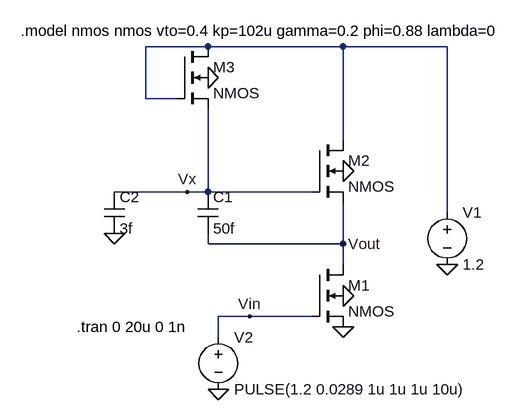
[diagram p0: schematic HW12.asc]
HW12.asc, the LTspice schematic file:
Version 4
SHEET 1 888 680
WIRE -64 -240 -160 -240
WIRE 144 -240 -64 -240
WIRE 304 -240 144 -240
WIRE -160 -160 -160 -240
WIRE -112 -160 -160 -160
WIRE 144 -96 144 -240
WIRE -96 -16 -208 -16
WIRE -64 -16 -64 -144
WIRE -64 -16 -96 -16
WIRE 96 -16 -64 -16
WIRE 304 16 304 -240
WIRE -64 64 -64 48
WIRE 144 64 144 0
WIRE 144 64 -64 64
WIRE 144 96 144 64
WIRE 0 176 -48 176
WIRE 96 176 0 176
WIRE -48 208 -48 176
FLAG 144 -48 0
FLAG 144 144 0
FLAG -64 -192 0
FLAG -208 48 0
FLAG 304 96 0
FLAG 144 192 0
FLAG -48 288 0
FLAG 0 176 Vin
FLAG 144 64 Vout
FLAG -96 -16 Vx
SYMBOL nmos4 96 96 R0
SYMATTR InstName M1
SYMATTR Value2 l=0.1u w=1u
SYMBOL nmos4 96 -96 R0
SYMATTR InstName M2
SYMATTR Value2 l=0.1u w=0.5u
SYMBOL nmos4 -112 -240 R0
SYMATTR InstName M3
SYMATTR Value2 l=0.1u w=0.5u
SYMBOL voltage 304 0 R0
SYMATTR InstName V1
SYMATTR Value 1.2
SYMBOL cap -80 -16 R0
SYMATTR InstName C1
SYMATTR Value 50f
SYMBOL cap -224 -16 R0
SYMATTR InstName C2
SYMATTR Value 3f
SYMBOL voltage -48 192 R0
WINDOW 123 0 0 Left 2
WINDOW 39 0 0 Left 2
SYMATTR InstName V2
SYMATTR Value PULSE(1.2 0.0289 1u 1u 1u 10u)
TEXT -352 -264 Left 2 !.model nmos nmos vto=0.4 kp=102u gamma=0.2 phi=0.88 lambda=0
TEXT -266 192 Left 2 !.tran 0 20u 0 1n

The netlist it stands for:
* HW12.asc
M1 Vout Vin 0 0 NMOS l=0.1u w=1u
M2 N001 Vx Vout 0 NMOS l=0.1u w=0.5u
M3 N001 N001 Vx 0 NMOS l=0.1u w=0.5u
V1 N001 0 1.2
C1 Vx Vout 50f
C2 Vx 0 3f
V2 Vin 0 PULSE(1.2 0.0289 1u 1u 1u 10u)
.model NMOS NMOS
.model PMOS PMOS
.lib standard.mos
.model nmos nmos vto=0.4 kp=102u gamma=0.2 phi=0.88 lambda=0
.tran 0 20u 0 1n
.backanno
.end